# Altium schematic sheet tcan.SchDoc
size A4
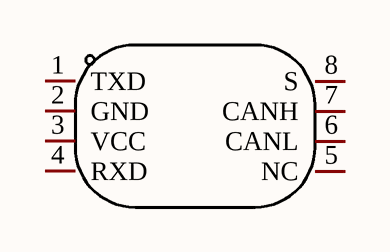
[diagram p0: tcan.SchDoc]

## Parts
?  TCAN1051HDR  (value not drawn)

## Nets

Not connected (* = marked no-connect by the designer): ? 1(TXD) 2(GND) 3(VCC) 4(RXD) 5(NC) 6(CANL) 7(CANH) 8(S)

## Library data of the parts
? = TCAN1051HDR: Manufacturer: TI(德州仪器); Add into BOM: yes; Protocol: CAN总线; Data Rate: 2Mbps; Supply Voltage: 4.5V ~ 5.5V; Symbol: TCAN1051HDR; Device: TCAN1051HDR; LCSC Part Name: TCAN1051HDR; Supplier Part: C129307; Manufacturer Part: TCAN1051HDR; Supplier Footprint: SOIC-8_150mil; JLCPCB Part Class: Extended Part; Datasheet: https://atta.szlcsc.com/upload/public/pdf/source/20170914/C129307_1505359939739968149.pdf; Supplier: LCSC; Convert to PCB: yes; Type: 收发器